# EAGLE design GloveMouse (EAGLE 6.1)
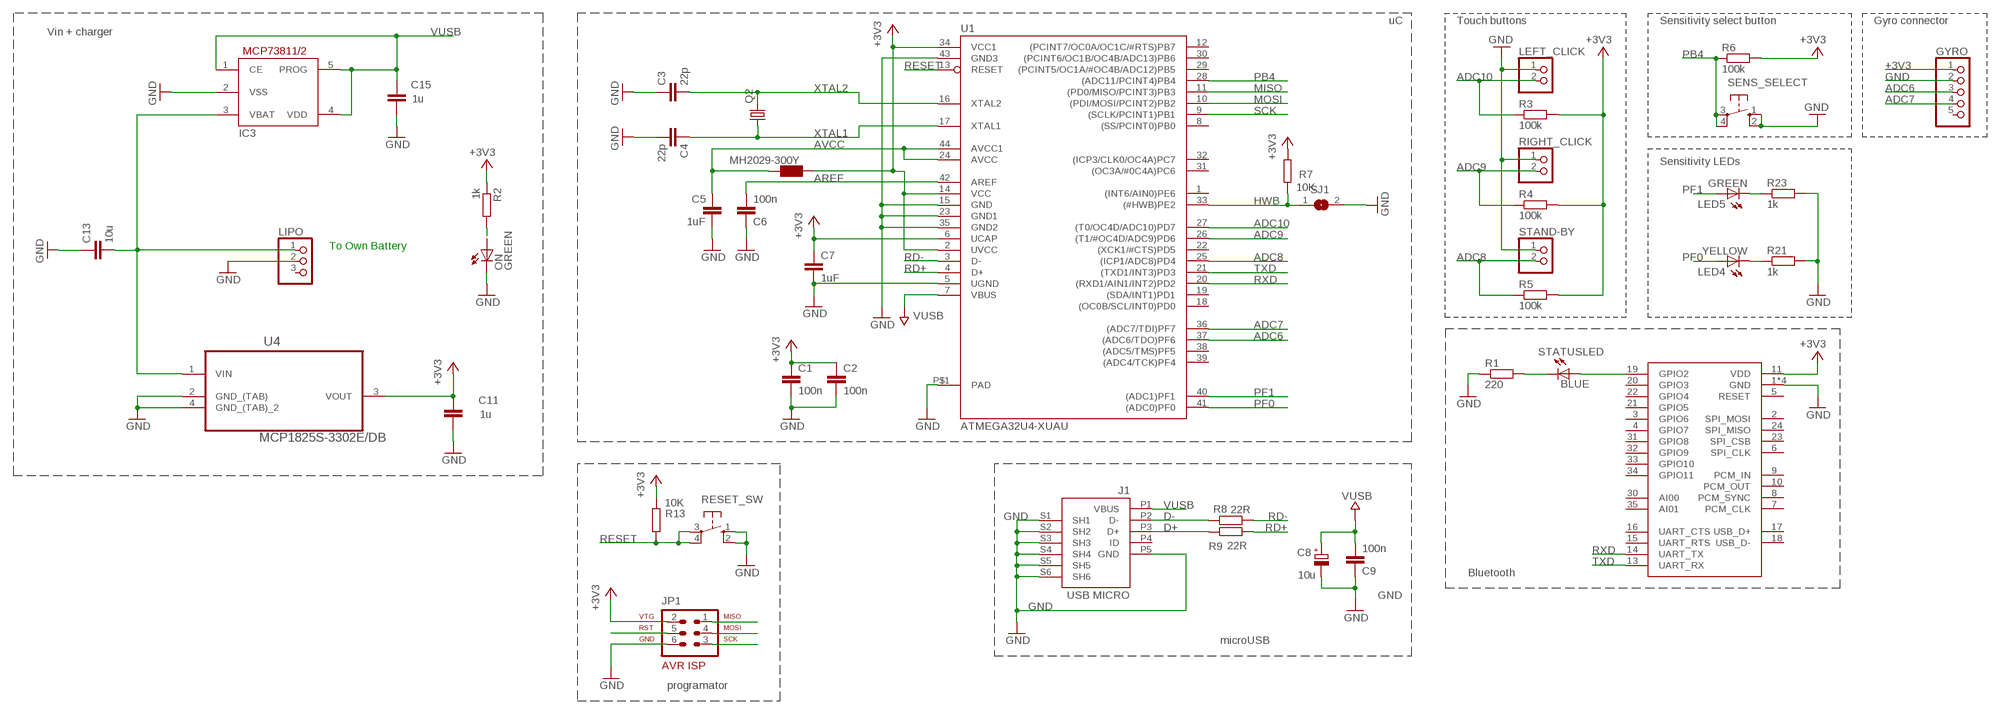
[diagram p0: schematic, sheet 1]

## Parts
C1  100n  C-EUC0603  [C0603-ROUND]
C2  100n  C-EUC0603  [C0603-ROUND]
C3  22p  C-EUC0603  [C0603-ROUND]
C4  22p  C-EUC0603  [C0603-ROUND]
C5  1uF  C-EUC0603  [C0603-ROUND]
C6  100n  C-EUC0603  [C0603-ROUND]
C7  1uF  C-EUC0603  [C0603-ROUND]
C8  10u  CPOL-EUSMCB  [SMC_B]
C9  100n  C-EUC0603  [C0603-ROUND]
C11  1u  C-EUC0603  [C0603-ROUND]
C13  10u  C-EUC0603  [C0603]
C15  1u  C-EUC0603  [C0603-ROUND]
GYRO  PINHD-1X5  [1X05]
IC3  MCP73811/2  [SOT23-5L]
J1  USB MICRO  MYCON2_USB-MINI-B  [CON2_USB_MICRO_B_AT]
JP1  AVR-ISP-6  [AVR-ISP-6]
L1  MH2029-300Y  WE-CBF_0805  [0805]
LED4  YELLOW  LEDCHIP-LED0805  [CHIP-LED0805]
LED5  GREEN  LEDCHIP-LED0805  [CHIP-LED0805]
LEFT_CLICK  PINHD-1X2  [1X02]
LIPO  PINHD-1X3  [1X03]
ON  GREEN  LEDCHIP-LED0805  [CHIP-LED0805]
Q2  CRYSTALCTS406  [CTS406]
R1  220  R-EU_R0603  [R0603]
R2  1k  R-EU_R0603  [R0603]
R3  100k  R-EU_R0603  [R0603]
R4  100k  R-EU_R0603  [R0603]
R5  100k  R-EU_R0603  [R0603]
R6  100k  R-EU_R0603  [R0603]
R7  10K  R-EU_R0603  [R0603-ROUND]
R8  22R  R-EU_R0603  [R0603-ROUND]
R9  22R  R-EU_R0603  [R0603-ROUND]
R13  10K  R-EU_R0603  [R0603-ROUND]
R21  1k  R-EU_R0603  [R0603]
R23  1k  R-EU_R0603  [R0603]
RESET_SW  10-XX  [B3F-10XX]
RIGHT_CLICK  PINHD-1X2  [1X02]
SENS_SELECT  10-XX  [B3F-10XX]
SJ1  SJ  [SJ]
STAND-BY  PINHD-1X2  [1X02]
STATUSLED  BLUE  LEDCHIP-LED0805  [CHIP-LED0805]
U1  ATMEGA32U4-XUAU  [TQFP44-PAD]
U4  MCP1825S-3302E/DB  [SOT230P700X180-4N]
U$1  RN42  [RN42]

## Nets
+3V3: C1.1 C2.1 C7.1 C11.2 GYRO.1 JP1.2 L1.1 R2.1 R3.2 R4.2 R5.2 R6.2 R7.1 R13.2 U1.2(UVCC) U1.6(UCAP) U1.14(VCC) U1.34(VCC1) U4.3(VOUT) U$1.11(VDD)
ADC6: GYRO.3 U1.37((ADC6/TDO)PF6)
ADC7: GYRO.4 U1.36((ADC7/TDI)PF7)
ADC8: R5.1 STAND-BY.2 U1.25((ICP1/ADC8)PD4)
ADC9: R4.1 RIGHT_CLICK.2 U1.26((T1/#OC4D/ADC9)PD6)
ADC10: LEFT_CLICK.2 R3.1 U1.27((T0/OC4D/ADC10)PD7)
AREF [aref]: C6.2 U1.42(AREF)
AVCC: C5.1 L1.2 U1.24(AVCC) U1.44(AVCC1)
D+: J1.P3(D+) R9.1
D-: J1.P2(D-) R8.1
GND [gnd]: C1.2 C2.2 C3.1 C4.2 C5.2 C6.1 C7.2 C8.- C9.1 C11.1 C13.1 C15.1 GYRO.2 IC3.2(VSS) J1.P5(GND) J1.S1(SH1) J1.S2(SH2) J1.S3(SH3) J1.S4(SH4) J1.S5(SH5) J1.S6(SH6) JP1.6 LEFT_CLICK.1 LIPO.2 ON.C R1.1 R21.2 R23.2 RESET_SW.1(S) RESET_SW.2(S1) RIGHT_CLICK.1 SENS_SELECT.1(S) SENS_SELECT.2(S1) SJ1.2 STAND-BY.1 U1.5(UGND) U1.15(GND) U1.23(GND1) U1.35(GND2) U1.43(GND3) U1.P$1(PAD) U4.2(GND_(TAB)) U4.4(GND_(TAB)_2) U$1.1(GND) U$1.12(GND) U$1.28(GND) U$1.29(GND)
HWB: R7.2 SJ1.1 U1.33((#HWB)PE2)
MISO: JP1.1 U1.11((PD0/MISO/PCINT3)PB3)
MOSI: JP1.4 U1.10((PDI/MOSI/PCINT2)PB2)
N$1: LED5.C R23.1
N$2: LED4.C R21.1
N$3: ON.A R2.2
N$5: C13.2 IC3.3(VBAT) LIPO.1 U4.1(VIN)
N$7: STATUSLED.A U$1.19(GPIO2)
N$8: R1.2 STATUSLED.C
PB4: R6.1 SENS_SELECT.3(P) SENS_SELECT.4(P1) U1.28((ADC11/PCINT4)PB4)
PF0: LED4.A U1.41((ADC0)PF0)
PF1: LED5.A U1.40((ADC1)PF1)
RD+: R9.2 U1.4(D+)
RD-: R8.2 U1.3(D-)
RESET: JP1.5 R13.1 RESET_SW.3(P) RESET_SW.4(P1) U1.13(RESET)
RXD: U1.20((RXD1/AIN1/INT2)PD2) U$1.14(UART_TX)
SCK: JP1.3 U1.9((SCLK/PCINT1)PB1)
TXD: U1.21((TXD1/INT3)PD3) U$1.13(UART_RX)
VUSB: C8.+ C9.2 C15.2 IC3.1(CE) IC3.4(VDD) IC3.5(PROG) J1.P1(VBUS) U1.7(VBUS)
XTAL1: C4.1 Q2.1 U1.17(XTAL1)
XTAL2: C3.2 Q2.3 U1.16(XTAL2)
Unconnected: GYRO.5 J1.P4(ID) LIPO.3 U1.1((INT6/AIN0)PE6) U1.8((SS/PCINT0)PB0) U1.12((PCINT7/OC0A/OC1C/#RTS)PB7) U1.18((OC0B/SCL/INT0)PD0) U1.19((SDA/INT1)PD1) U1.22((XCK1/#CTS)PD5) U1.29((PCINT5/OC1A/#OC4B/ADC12)PB5) U1.30((PCINT6/OC1B/OC4B/ADC13)PB6) U1.31((OC3A/#0C4A)PC6) U1.32((ICP3/CLK0/OC4A)PC7) U1.38((ADC5/TMS)PF5) U1.39((ADC4/TCK)PF4) U$1.2(SPI_MOSI) U$1.3(GPIO6) U$1.4(GPIO7) U$1.5(RESET) U$1.6(SPI_CLK) U$1.7(PCM_CLK) U$1.8(PCM_SYNC) U$1.9(PCM_IN) U$1.10(PCM_OUT) U$1.15(UART_RTS) U$1.16(UART_CTS) U$1.17(USB_D+) U$1.18(USB_D-) U$1.20(GPIO3) U$1.21(GPIO5) U$1.22(GPIO4) U$1.23(SPI_CSB) U$1.24(SPI_MISO) U$1.30(AI00) U$1.31(GPIO8) U$1.32(GPIO9) U$1.33(GPIO10) U$1.34(GPIO11) U$1.35(AI01)

## Notes on the sheet
- uC | Touch buttons | Sensitivity select button | Gyro connector
- Vin + charger
- Sensitivity LEDs
- To Own Battery
- Bluetooth
- microUSB
- programator

## Library data of the parts
C1-C7 C9 C11 C15 = SmartPrj:C-EU: CAPACITOR, European symbol
C8 = rcl:CPOL-EU: POLARIZED CAPACITOR, European symbol
C13 = rcl:C-EU: CAPACITOR, European symbol
GYRO = pinhead:PINHD-1X5: PIN HEADER
IC3 = adafruit:MCP73811/2: MCP73811 and MCP73812 Simple, Miniature Single-Cell, Fully Integrated Li-Ion / Li-Polymer Charge Management Controllers SOT-23-5 package, no indicator LED but with adjustable current, small and very inexpensive
J1 = SmartPrj:MYCON2_USB-MINI-B
JP1 = avr-5:AVR-ISP-6: AVR ISP-6 Serial Programming Header
L1 = wuerth-elektronik:WE-CBF: SMD EMI Suppression Ferrite Beads - excellent anti-EMI properties - low DCR - impedances till 3000 ohms - rated current up to 6 A
LED4 LED5 ON STATUSLED = led:LED: LED OSRAM: - CHIPLED LG R971, LG N971, LY N971, LG Q971, LY Q971, LO R971, LY R971 LH N974, LH R974 LS Q976, LO Q976, LY Q976 LO Q996 - Hyper CHIPLED LW Q18S LB Q993, LB Q99A, LB R99A - SideLED LS A670, LO A670, LY A670, LG A670, LP A670 LB A673, LV A673, LT A673, LW A673 LH A674 LY A675 LS A676, LA A676, LO A676, LY A676, LW A676 LS A679, LY A679, LG A679 - Hyper Micro SIDELED® LS Y876, LA Y876, LO Y876, LY Y876 LT Y87S - SmartLED LW L88C, LW L88S LB L89C, LB L89S, LG L890 LS L89K, LO L89K, LY L89K LS L896, LA L896, LO L896, LY L896 - TOPLED LS T670, LO T670, LY T670, LG T670, LP T670 LSG T670, LSP T670, LSY T670, LOP T670, LYG T670 LG T671, LOG T671, LSG T671 LB T673, LV T673, LT T673, LW T673 LH T674 LS T676, LA T676, LO T676, LY T676, LB T676, LH T676, LSB T676, LW T676 LB T67C, LV T67C, LT T67C, LS T67K, LO T67K, LY T67K, LW E67C LS E67B, LA E67B, LO E67B, LY E67B, LB E67C, LV E67C, LT E67C LW T67C LS T679, LY T679, LG T679 LS T770, LO T770, LY T770, LG T770, LP T770 LB T773, LV T773, LT T773, LW T773 LH T774 LS E675, LA E675, LY E675, LS T675 LS T776, LA T776, LO T776, LY T776, LB T776 LHGB T686 LT T68C, LB T68C - Hyper Mini TOPLED® LB M676 - Mini TOPLED Santana® LG M470 LS M47K, LO M47K, LY M47K Source: http://www.osram.convergy.de LUXEON: - LUMILED® LXK2-PW12-R00, LXK2-PW12-S00, LXK2-PW14-U00, LXK2-PW14-V00 LXK2-PM12-R00, LXK2-PM12-S00, LXK2-PM14-U00 LXK2-PE12-Q00, LXK2-PE12-R00, LXK2-PE12-S00, LXK2-PE14-T00, LXK2-PE14-U00 LXK2-PB12-K00, LXK2-PB12-L00, LXK2-PB12-M00, LXK2-PB14-N00, LXK2-PB14-P00, LXK2-PB14-Q00 LXK2-PR12-L00, LXK2-PR12-M00, LXK2-PR14-Q00, LXK2-PR14-R00 LXK2-PD12-Q00, LXK2-PD12-R00, LXK2-PD12-S00 LXK2-PH12-R00, LXK2-PH12-S00 LXK2-PL12-P00, LXK2-PL12-Q00, LXK2-PL12-R00 Source: www.luxeon.com KINGBRIGHT: KA-3528ASYC Source: www.kingbright.com
LEFT_CLICK RIGHT_CLICK STAND-BY = pinhead:PINHD-1X2: PIN HEADER
LIPO = pinhead:PINHD-1X3: PIN HEADER
Q2 = crystal:CRYSTAL: CRYSTAL
R1-R6 R21 R23 = resistor:R-EU_: RESISTOR, European symbol
R7-R9 R13 = SmartPrj:R-EU_: RESISTOR, European symbol
RESET_SW SENS_SELECT = switch-omron:10-XX: OMRON SWITCH; MPN: B3F-1000; OC_FARNELL: 176432; OC_NEWARK: 36M3542
SJ1 = jumper:SJ: SMD solder JUMPER
U1 = SmartPrj:ATMEGA32U4-XU
U4 = dan:MCP1825S-3302E/DB: IC, LDO VOLT REG, 3.3V, 0.5A; MPN: MCP1825S-3302E/DB; OC_FARNELL: 1578404; OC_NEWARK: 26M9961; PACKAGE: SOT-223-3; SUPPLIER: Microchip
U$1 = Tudor's_spankin'_library:RN42: RN-42/RN-42-N Class 2 Bluetooth Module

## Net classes
0 default: width 0.254 mm, drill 0.61 mm, clearance 0.254 mm
1 power: width 0.254 mm, drill 0.61 mm, clearance 0.254 mm
2 gnd: width 0.254 mm, drill 0.61 mm, clearance 0.254 mm
3 usbvcc: width 0.254 mm, drill 0.61 mm, clearance 0.254 mm
4 aref: width 0.254 mm, drill 0.61 mm, clearance 0.254 mm

## Board
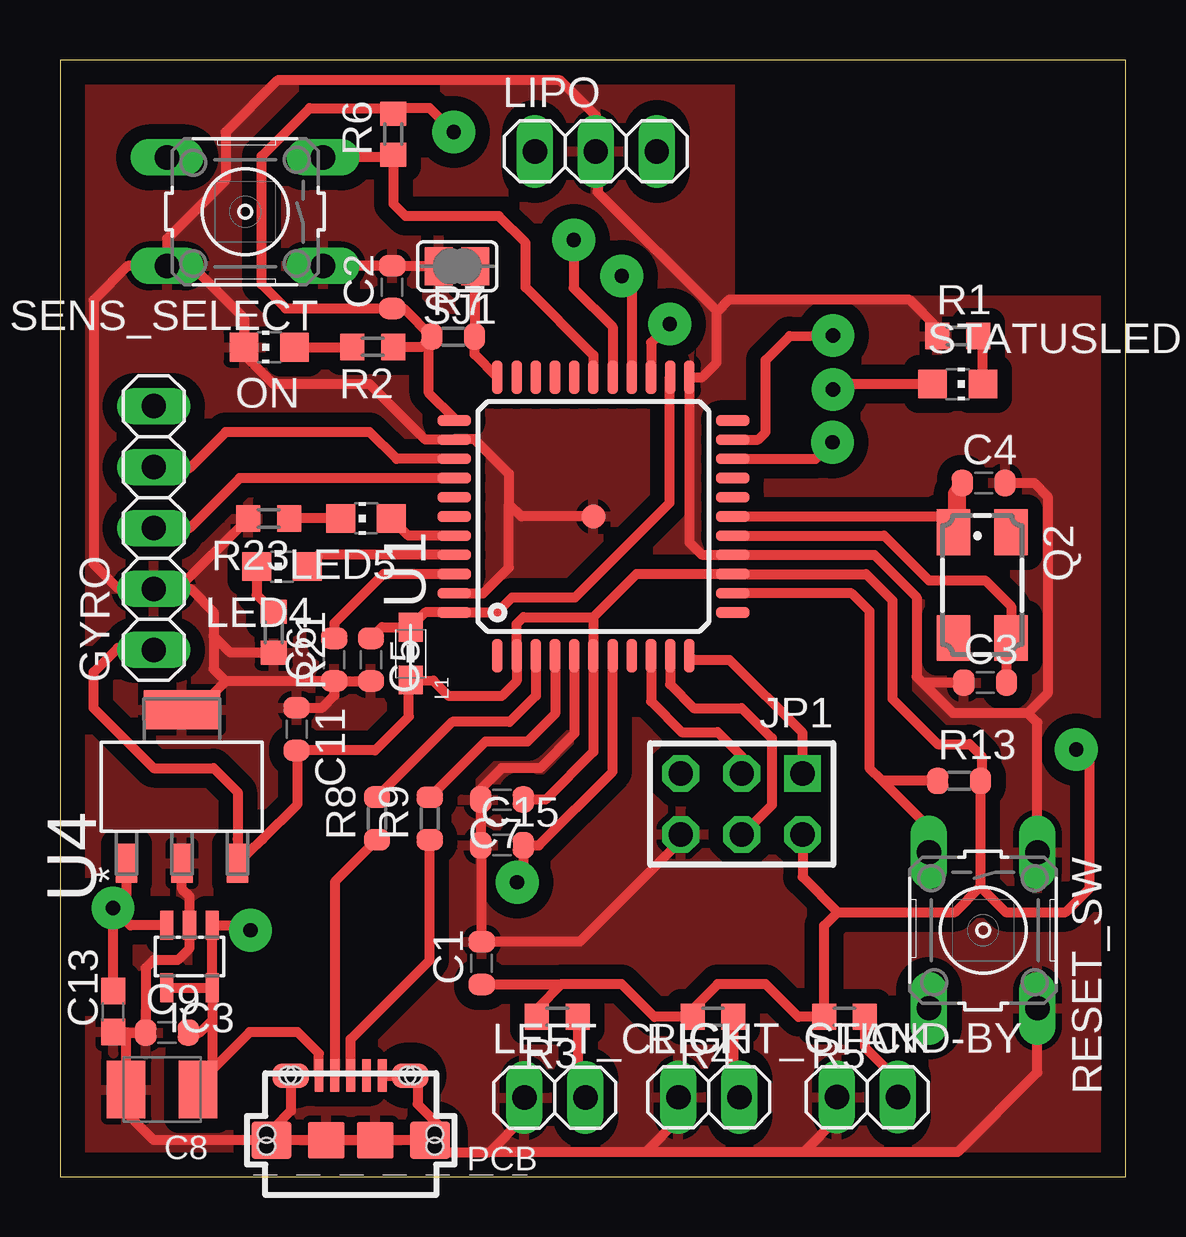
[diagram p1: board, top side]
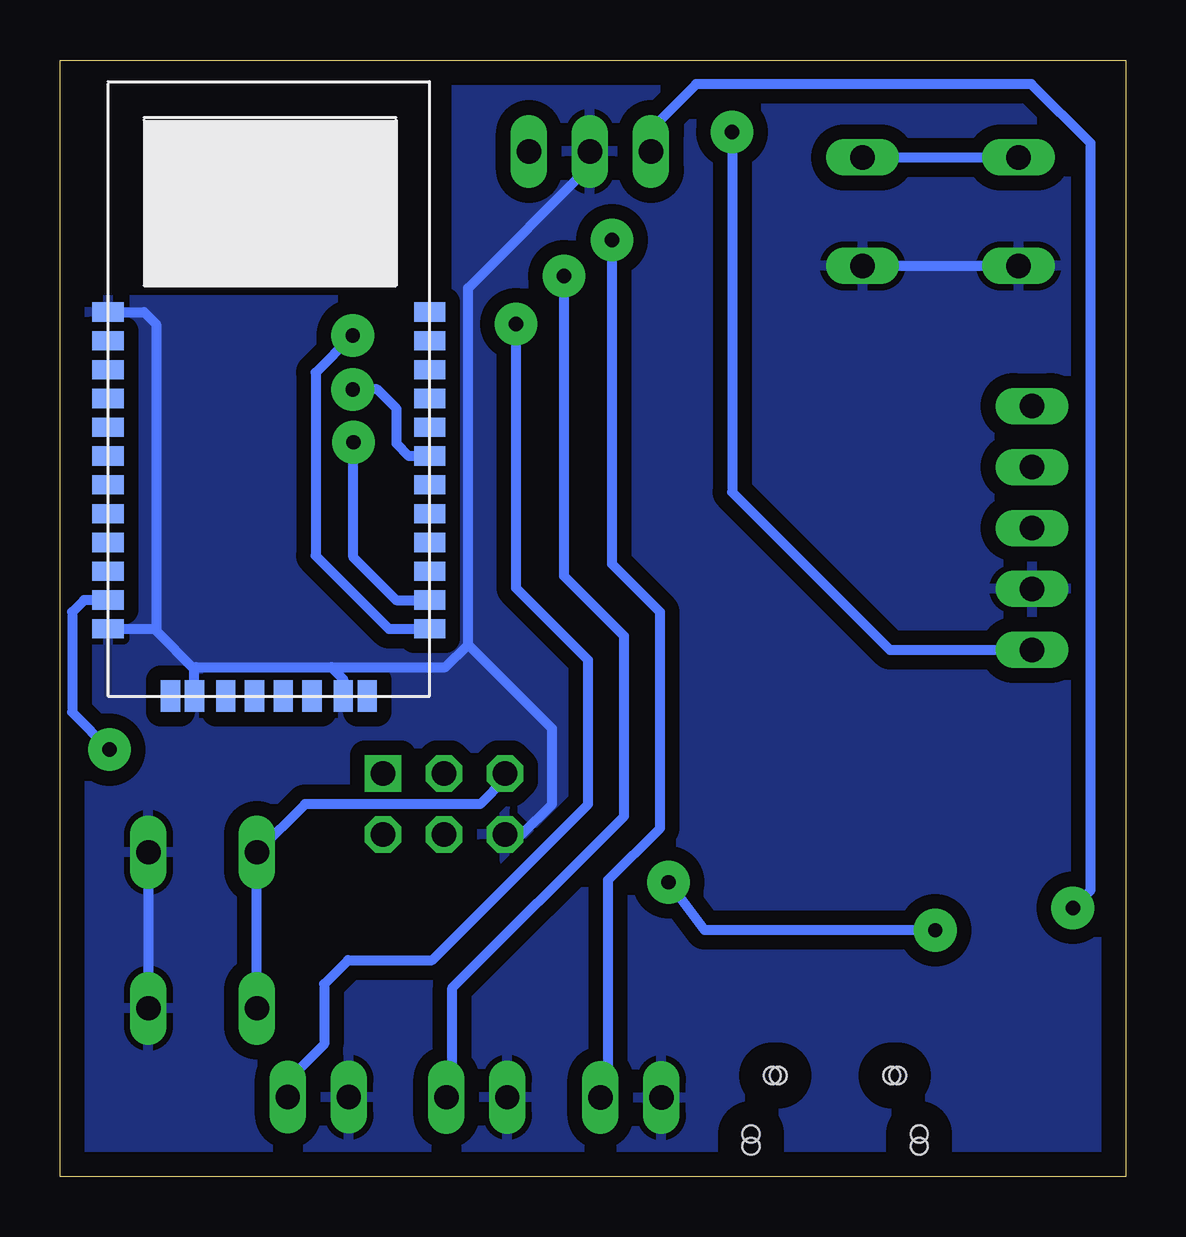
[diagram p2: board, bottom side, seen from below]

Size 44.41 x 46.54 mm. Coordinates in mm from the lower left corner, seen from the top.
Outline: 0,0 44.41,0 44.41,46.54 0,46.54 0,0
Copper layers (1*16): Top 0.035mm / dielectric 1.5mm / Bottom 0.035mm
Design rules: minimum track width 10mil, minimum drill 24mil, track to track 8mil, track to pad 8mil, pad to pad 8mil, via to via 8mil, smd to smd 8mil, copper to edge 40mil, drill to drill 8mil, minimum pad ring 10mil, minimum via ring 8mil, stop-mask expansion 4mil, vias tented up to drill 0mil, thermal gap 10mil

### Footprints (pad centres in the part's own frame; a part is rotated, then mirrored left to right if it is on the bottom)
C0603-ROUND = smd 0.898 x 1.1: 1 -0.889,0; 2 0.889,0
SMC_B = smd 1.6 x 2.4: + -1.5,0; - 1.5,0
C0603 = smd 1.1 x 1: 1 -0.85,0; 2 0.85,0
1X05 = drill 1.016 long: 1 -5.08,0; 2 -2.54,0; 3 0,0; 4 2.54,0; 5 5.08,0
SOT23-5L = smd 0.55 x 1.2: 1 -0.95,-1.3; 2 0,-1.3; 3 0.95,-1.3; 4 0.95,1.3; 5 -0.95,1.3
CON2_USB_MICRO_B_AT = smd 0.406 x 1.346: P1 -1.321,2.692; P2 -0.66,2.692; P3 0,2.692; P4 0.66,2.692; P5 1.321,2.692 | smd 1.651 x 1.549: S1 -3.302,0; S2 3.302,0 | smd 1.524 x 1.016: S3 -2.489,2.692; S4 2.489,2.692 | smd 1.524 x 1.524: S5 -1.016,0; S6 1.016,0 | hole 0.7: -3.505,0.254; -3.505,-0.254; 3.505,0.254; 3.505,-0.254; -2.616,2.692; -2.362,2.692; 2.362,2.692; 2.616,2.692
AVR-ISP-6 = drill 1.016 square: 1 -2.54,-1.27 | drill 1.016 octagon: 2 -2.54,1.27; 3 0,-1.27; 4 0,1.27; 5 2.54,-1.27; 6 2.54,1.27
0805 = smd 1.2 x 1: 1 -1.1,0; 2 1.1,0
CHIP-LED0805 = smd 1.2 x 1.2: A 0,-1.05; C 0,1.05
1X02 = drill 1.016 long: 1 -1.27,0; 2 1.27,0
1X03 = drill 1.016 long: 1 -2.54,0; 2 0,0; 3 2.54,0
CTS406 = smd 1.9 x 1.4: 1 -2.2,-1.2; 2 2.2,-1.2; 3 2.2,1.2; 4 -2.2,1.2
R0603 = smd 1 x 1.1: 1 -0.85,0; 2 0.85,0
R0603-ROUND = smd 0.898 x 1.1: 1 -0.889,0; 2 0.889,0
B3F-10XX = drill 1.016 long: 1 -3.251,2.261; 2 3.251,2.261; 3 -3.251,-2.261; 4 3.251,-2.261
SJ = smd 1.168 x 1.6: 1 -0.762,0; 2 0.762,0
TQFP44-PAD = smd 1.4 x 0.45: 1 -5.8,4; 2 -5.8,3.2; 3 -5.8,2.4; 4 -5.8,1.6; 5 -5.8,0.8; 6 -5.8,0; 7 -5.8,-0.8; 8 -5.8,-1.6; 9 -5.8,-2.4; 10 -5.8,-3.2; 11 -5.8,-4; 23 5.8,-4; 24 5.8,-3.2; 25 5.8,-2.4; 26 5.8,-1.6; 27 5.8,-0.8; 28 5.8,0; 29 5.8,0.8; 30 5.8,1.6; 31 5.8,2.4; 32 5.8,3.2; 33 5.8,4 | smd 0.45 x 1.4: 12 -4,-5.8; 13 -3.2,-5.8; 14 -2.4,-5.8; 15 -1.6,-5.8; 16 -0.8,-5.8; 17 0,-5.8; 18 0.8,-5.8; 19 1.6,-5.8; 20 2.4,-5.8; 21 3.2,-5.8; 22 4,-5.8; 34 4,5.8; 35 3.2,5.8; 36 2.4,5.8; 37 1.6,5.8; 38 0.8,5.8; 39 0,5.8; 40 -0.8,5.8; 41 -1.6,5.8; 42 -2.4,5.8; 43 -3.2,5.8; 44 -4,5.8 | smd 1 x 1: P$1 0,0
SOT230P700X180-4N = smd 1.626 x 0.889: 1 -3.2,2.311; 2 -3.2,0; 3 -3.2,-2.311 | smd 1.626 x 3.175: 4 3.2,0
RN42 = smd 1.3 x 0.8: 1 0,16; 2 0,14.8; 3 0,13.6; 4 0,12.4; 5 0,11.2; 6 0,10; 7 0,8.8; 8 0,7.6; 9 0,6.4; 10 0,5.2; 11 0,4; 12 0,2.8; 13 13.4,2.8; 14 13.4,4; 15 13.4,5.2; 16 13.4,6.4; 17 13.4,7.6; 18 13.4,8.8; 19 13.4,10; 20 13.4,11.2; 21 13.4,12.4; 22 13.4,13.6; 23 13.4,14.8; 24 13.4,16 | smd 0.8 x 1.3: 28 9.8,0; 29 3.6,0; 30 10.8,0; 31 8.5,0; 32 7.3,0; 33 6.1,0; 34 4.9,0; 35 2.6,0

### Placement (x,y rotation side)
C1  17.57,8.91 90 top
C2  13.84,37.08 90 top
C3  38.55,20.6 0 top
C4  38.49,28.92 0 top
C5  12.95,21.55 270 top
C6  11.43,21.55 90 top
C7  18.42,15.72 180 top
C8  4.25,3.64 180 top
C9  4.46,6.01 0 top
C11  9.86,18.66 270 top
C13  2.22,6.89 90 top
C15  18.42,13.82 0 top
GYRO  3.91,27.04 90 top
IC3  5.4,9.18 180 top
J1  12.11,1.53 0 top
JP1  28.41,15.54 180 top
L1  14.6,21.8 90 top
LED4  9.25,25.43 90 top
LED5  12.75,27.44 90 top
LEFT_CLICK  20.62,3.3 0 top
LIPO  22.33,42.73 0 top
ON  8.72,34.58 90 top
Q2  38.43,24.66 270 top
R1  37.41,35.04 0 top
R2  13.03,34.59 180 top
R3  20.72,6.67 180 top
R4  27.21,6.67 180 top
R5  32.69,6.67 180 top
R6  13.89,43.45 90 top
R7  16.38,35.01 0 top
R8  13.21,14.94 90 top
R9  15.41,14.93 90 top
R13  37.46,16.5 0 top
R21  8.91,22.69 270 top
R23  8.7,27.44 180 top
RESET_SW  38.46,10.28 270 top
RIGHT_CLICK  27.04,3.32 0 top
SENS_SELECT  7.71,40.22 180 top
SJ1  16.55,37.95 180 top
STAND-BY  33.64,3.33 0 top
STATUSLED  37.41,33.04 270 top
U1  22.23,27.52 90 top
U4  5.08,16.27 90 top
U$1  42.41,20.04 0 bottom

### Tracks (layer width: path | path; a pad name or v marks a point on that pad's centre or on a via)
+3V3  (via drill 0.6 pad 1.78)
  Top 0.406: 22.23,23.33 19.3,23.33 19.03,23.05 U1.2 19.03,20.66 18.41,20.04 16.2,20.04 15.56,20.68 L1.1 14.54,20.64 14.54,19.18 13.13,17.77 C11.2 9.9,17.72 9.9,15.54 8.43,14.06 U4.3 7.41,14.08 7.41,16.04 6.41,17.04 3.91,17.04 1.41,19.54 1.41,21.04 2.41,22.04 3.83,22.04 GYRO.1 | C7.1 20.23,15.72 22.23,17.72 U1.6 22.23,23.33 | U1.34 16.43,31.61 15.37,32.66 15.37,34.95 R7.1 | 22.23,23.33 24.02,25.12 U1.14 33.59,25.12 34.69,24.02 34.69,19.93 36.57,18.04 37.91,18.04 38.41,17.54 38.41,16.55 R13.2 38.35,12.09 | R7.1 14.32,36.19 C2.1 9.4,36.19 8.4,37.19 8.4,42.54 10.4,44.54 13.9,44.54 | 13.62,44.04 R6.2 13.88,44.52 13.9,44.54 | R2.1 15.07,34.59 R7.1 | v42.34,17.81 42.91,17.25 42.91,12.04 41.91,11.04 39.41,11.04 38.35,12.09 | JP1.2 30.95,12.5 32.41,11.04 | 32.41,11.04 37.3,11.04 38.35,12.09 | 32.41,11.04 31.84,10.48 R5.2 30.77,6.67 29.41,8.04 27.41,8.04 26.41,7.04 26.41,6.73 R4.2 24.77,6.67 23.41,8.04 20.91,8.04 20.89,8.02 | 20.89,8.02 19.91,7.04 19.91,6.71 R3.2 | C1.1 20.89,8.02 | 16.43,43.52 v16.41,43.54 15.4,44.54 13.9,44.54
  Bottom 0.406: U$1.11 43.41,24.04 43.91,23.54 43.91,19.37 v42.34,17.81 | v16.41,43.54 16.41,28.54 9.82,21.96 GYRO.1
ADC6
  Top 0.406: U1.37 7.49,29.12 5.41,27.04 GYRO.3
ADC7
  Top 0.406: U1.36 14.02,29.92 12.9,31.04 6.91,31.04 5.41,29.54 3.95,29.54 GYRO.4
ADC8  (via drill 0.6 pad 1.78)
  Top 0.406: v25.41,35.54 24.62,34.76 U1.25 | R5.1 33.54,5.41 34.91,4.04 STAND-BY.2
  Bottom 0.406: v25.41,35.54 25.41,24.54 22.41,21.54 22.41,15.54 28.91,9.04 32.41,9.04 33.41,8.04 33.41,5.54 34.91,4.04 STAND-BY.2
ADC9  (via drill 0.6 pad 1.78)
  Top 0.406: v23.41,37.54 23.83,37.46 U1.26 | R4.1 28.05,3.58 RIGHT_CLICK.2
  Bottom 0.406: RIGHT_CLICK.2 28.05,3.58 28.05,7.89 20.91,15.04 20.91,22.54 23.41,25.04 v23.41,37.54
ADC10  (via drill 0.6 pad 1.78)
  Top 0.406: v21.41,39.04 21.41,37.04 23.03,35.42 U1.27 | R3.1 21.57,3.62 LEFT_CLICK.2
  Bottom 0.406: LEFT_CLICK.2 21.57,3.62 21.57,12.38 19.41,14.54 19.41,23.54 21.41,25.54 v21.41,39.04
AREF
  Top 0.406: U1.42 13.47,25.12 11.43,23.07 C6.2
AVCC
  Top 0.406: U1.24 25.4,33.3 25.4,28.09 21.46,24.15 18.84,24.15 18.21,23.52 U1.44 15.22,23.52 L1.2 13.42,22.9 C5.1
D+
  Top 0.406: J1.P3 12.11,5.75 15.4,9.04 R9.1
D-
  Top 0.406: R8.1 11.45,12.29 J1.P2
GND
  Top 0.406: J1.S1 J1.S5 J1.S6 J1.S2 15.9,2.02 | C15.1 C7.2 17.53,16.16 18.41,17.04 20,17.04 21.44,18.48 21.44,21.73 U1.5 | J1.S4 J1.P5 14.72,4.22 14.9,4.04 14.9,3.04 15.9,2.04 15.9,2.02 | 2.75,5.96 2.75,6.02 C13.1 | C8.- 2.75,5.96 | 3.56,6.44 3.56,6.54 3.57,6.53 | SJ1.2 15.94,37.97 C2.2 12.97,37.97 SENS_SELECT.1 | C6.1 C5.2 | 2.73,3.62 C8.- | C3.1 35.95,20.6 | 35.95,20.6 35.69,20.85 35.69,24.15 33.93,25.92 U1.15 28.01,25.93 26.73,25.93 26.23,26.44 U1.23 26.76,33.32 27.36,33.93 27.36,36.04 | C4.2 40.58,28.92 41.16,28.34 41.16,20.15 40.33,19.33 | 40.33,19.33 37.22,19.33 35.95,20.6 | U1.5 | U1.5 | U1.43 17.63,24.32 18.7,25.39 18.7,28.04 | 18.7,28.04 18.7,29.3 17.25,30.76 16.46,30.76 U1.35 15.22,30.72 12.9,33.04 8.9,33.04 7.91,34.04 7.91,34.34 ON.C 7.67,35.78 5.49,37.96 SENS_SELECT.2 | U1.P$1 19.22,27.52 18.7,28.04 | SENS_SELECT.2 4.46,39.1 6.91,41.54 6.91,43.54 9.06,45.7 20.85,45.7 22.33,44.22 LIPO.2 22.41,42.65 22.41,41.04 27.36,36.08 27.36,36.04 | 17.4,13.69 C15.1 | R1.1 36.55,35.39 35.4,36.55 27.87,36.55 27.36,36.04 | RESET_SW.1 40.73,18.93 40.33,19.33 | U4.2 5.08,12.56 5.08,12.01 5.4,11.69 5.4,10.54 IC3.2 5.4,9.53 4.91,9.04 3.91,9.04 3.57,8.7 3.57,6.53 | C6.1 6.91,20.66 | C6.1 11.43,20.06 10.9,19.54 9.87,19.54 C11.1 | 2.75,5.96 2.81,6.01 C9.1 3.57,6.53 | J1.S1 3.91,1.53 2.91,2.54 2.91,3.49 C8.- | J1.S3 9.62,2.76 8.9,2.04 8.9,1.63 J1.S1 | 15.9,2.02 15.9,1.04 17.91,1.04 | 17.91,1.04 19.35,2.49 LEFT_CLICK.1 | RIGHT_CLICK.1 25.77,2.4 24.41,1.04 | 24.41,1.04 17.91,1.04 | STAND-BY.1 32.37,2.43 30.98,1.04 | 30.98,1.04 24.41,1.04 | C15.1 17.57,13.77 C1.2 21.67,9.8 25.87,14 JP1.6 | 30.98,1.04 37.41,1.04 40.73,4.36 RESET_SW.2
  Top 0.406: 4.91,24.5 GYRO.2 3.87,24.54 2.41,24.54 1.41,25.54 1.41,36.54 2.82,37.96 SENS_SELECT.2 | 4.91,24.5 5.45,24.5 6.41,23.54 6.41,22.54 | 6.41,22.54 6.41,21.16 6.91,20.66 | U4.4 5.71,19.46 6.91,20.66 | R23.2 4.91,24.5 | R21.2 7.1,21.84 6.41,22.54
  Bottom 0.406: SENS_SELECT.1 SENS_SELECT.2 | RESET_SW.1 RESET_SW.2 | U$1.1 40.91,36.04 40.41,35.54 40.41,22.84 | U$1.12 40.41,22.84 | 38.8,21.16 38.73,21.24 33.1,21.24 | 33.1,21.24 32.6,20.74 U$1.28 | U$1.29 38.8,21.16 | 40.41,22.84 40.41,22.77 38.8,21.16 | 33.1,21.24 28.35,21.24 27.41,22.18 | 27.41,22.18 27.41,37.04 22.33,42.12 LIPO.2 | JP1.6 25.18,14.27 23.91,15.54 23.91,18.68 27.41,22.18
  pour Top (isolate 0.61): -0.09,0.04 -0.09,46.54 27.91,46.54 27.91,36.54 44.41,36.54 44.41,0.04
  pour Bottom (isolate 0.61): -0.09,0.04 -0.09,46.54 27.91,46.54 27.91,36.54 44.41,36.54 44.41,0.04
HWB
  Top 0.406: U1.33 17.27,34.27 R7.2 17.31,35.05 SJ1.1
MISO
  Top 0.406: JP1.1 30.95,18.5 27.91,21.54 26.41,21.54 U1.11
MOSI
  Top 0.406: U1.10 25.43,20.52 26.41,19.54 28.41,19.54 29.66,18.28 29.66,15.49 28.44,14.27 JP1.4
N$1
  Top 0.406: LED5.C R23.1
N$2
  Top 0.406: LED4.C 8.2,24.25 R21.1
N$3
  Top 0.406: ON.A 12.18,34.58 R2.2
N$5  (via drill 0.6 pad 1.78)
  Top 0.406: C13.2 2.22,11.2 v2.21,11.2 v2.2,11.21 | IC3.3 2.93,10.48 v2.2,11.21 | U4.1 2.77,11.78 v2.2,11.21
  Bottom 0.406: v2.2,11.21 1.46,11.95 1.46,43.07 3.93,45.54 17.91,45.54 19.91,43.54 19.91,42.85 LIPO.1
N$7  (via drill 0.6 pad 1.78)
  Top 0.406: STATUSLED.A 32.43,33.04 v32.21,32.82
  Bottom 0.406: U$1.19 29.87,30.04 30.38,30.55 30.38,32.01 31.19,32.82 v32.21,32.82
N$8
  Top 0.406: STATUSLED.C 38.45,34.84 R1.2
PB4
  Top 0.406: R6.1 13.92,42.48 SENS_SELECT.3 | 13.99,42.54 R6.1 | R6.1 13.9,42.58 13.9,40.54 14.4,40.04 18.29,40.04 19.41,38.92 19.41,37.07 22.23,34.24 U1.28
  Bottom 0.406: SENS_SELECT.3 SENS_SELECT.4
PF0
  Top 0.406: U1.41 10.78,25.92 LED4.A
PF1
  Top 0.406: U1.40 14.52,26.72 LED5.A
RD+
  Top 0.406: U1.4 20.62,19.29 19.47,18.14 17.72,18.14 R9.2
RD-
  Top 0.406: U1.3 19.83,20.05 18.74,18.96 16.34,18.96 R8.2
RESET
  Top 0.406: U1.13 32.99,24.32 33.73,23.58 33.73,17.04 34.26,16.5 | R13.1 34.26,16.5 | RESET_SW.3 36.2,14.56 34.26,16.5
  Bottom 0.406: RESET_SW.4 RESET_SW.3 34.19,15.54 26.91,15.54 25.87,16.58 JP1.5
RXD  (via drill 0.6 pad 1.78)
  Top 0.406: U1.20 31.49,29.92 v32.18,30.61
  Bottom 0.406: U$1.14 30.41,24.04 32.18,25.82 v32.18,30.61
SCK
  Top 0.406: U1.9 24.62,19.82 25.91,18.54 27.41,18.54 28.41,17.54 JP1.3
TXD  (via drill 0.6 pad 1.78)
  Top 0.406: U1.21 29.09,30.72 29.41,31.04 29.41,34.04 30.41,35.04 v32.21,35.06
  Bottom 0.406: U$1.13 30.71,22.84 33.76,25.89 33.76,33.52 v32.21,35.06
VUSB  (via drill 0.6 pad 1.78)
  Top 0.406: U1.7 23.03,16.89 19.96,13.82 C15.2 19.3,12.54 v19.05,12.28 | IC3.5 IC3.1 7.23,10.48 v7.94,10.28 | IC3.4 IC3.5 | 6.35,6.54 6.35,4.24 C8.+ | 5.79,3.61 C8.+ | C9.2 5.82,6.01 6.35,6.54 | IC3.5 6.35,6.54 | J1.P1 10.79,5.15 9.9,6.04 7.91,6.04 5.75,3.89 C8.+
  Bottom 0.406: v7.94,10.28 17.55,10.28 v19.05,12.28
XTAL1
  Top 0.406: U1.17 37.03,27.52 37.41,27.14 | 37.41,27.14 37.41,26.95 | 37.41,27.14 37.41,28.85 37.54,28.85 | Q2.1 37.23,27.39 | 37.23,27.39 37.23,28.54 37.54,28.85 | 37.54,28.85 C4.1 | 37.54,28.85 37.54,27.7 37.23,27.39
XTAL2
  Top 0.406: U1.16 34.34,26.72 36.2,24.85 38.55,24.85 39.63,23.77 Q2.3 39.91,22.46 | C3.2 39.44,22.19 39.7,22.44 39.91,22.44 39.91,22.46 | 39.91,22.46 39.91,22.54